# Altium project _stm32h7-hmi-display.PrjPCB (part 2 of 2)

## Sheet 08_POWER.SchDoc: =GlobalProjectName
size 594 x 420 mm; ApprovedBy: Галкин; CheckedBy: Галкин; Author: Данич; Organization: A_D Electronics; DocumentNumber: - Э3; Revision: 0; SheetNumber: 8; SheetTotal: 8; PageSetup: Record=PageOptions|CenterHorizontal=True|CenterVertical=True|PrintScale=0.70|XCorrection=1.00|YCorrection=1.00|PrintKind=2|BorderSize=5000000|LeftOffset=9000|BottomOffset=10100|Orientation=2|PaperLength=11176|PaperWidth=8636|Scale=100|PaperSource=259|PrintQuality=-3|MediaType=1|DitherType=10|PrintScaleMode=1|PaperKind=A3|PaperIndex=8; FirstApplication: -; DocumentName: stm32h7-hmi-display
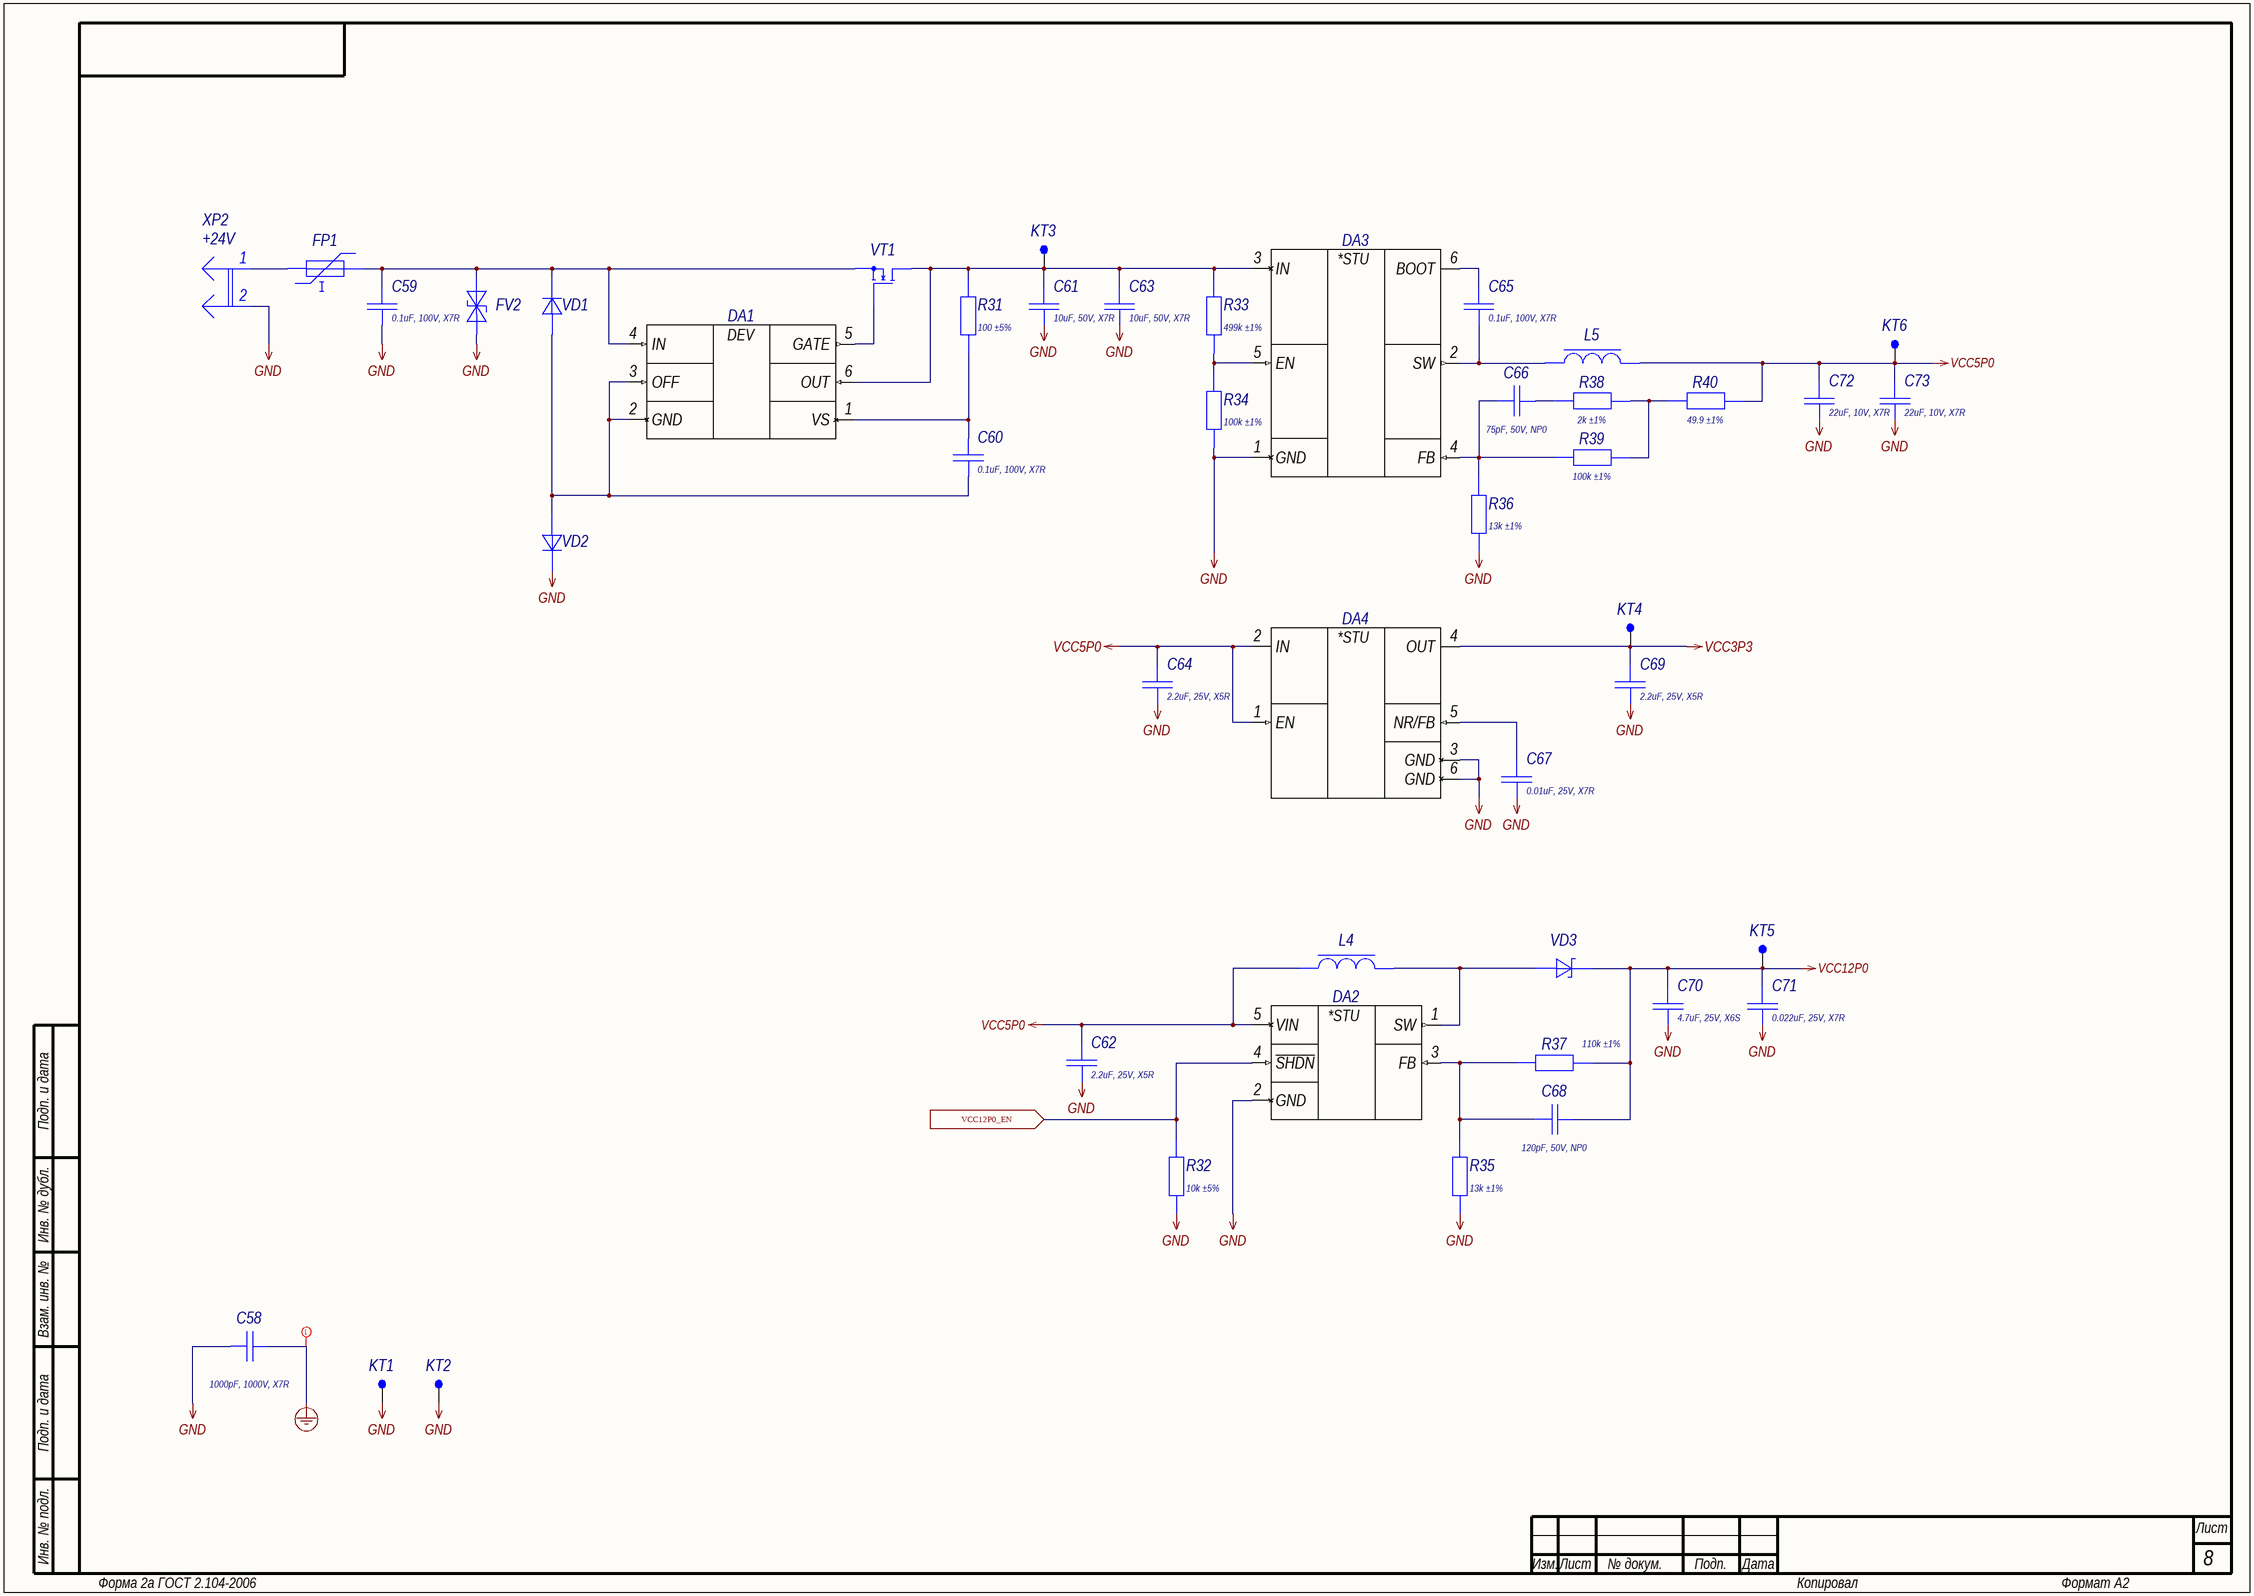
[diagram p7: 08_POWER.SchDoc]

### Parts
C58  Schematic Value: 1000pF, 1000V, X7R  [C1206]  (hidden comment: Capacitor)
C59  Schematic Value: 0.1uF, 100V, X7R  [C0603_L]  (hidden comment: Capacitor)
C60  Schematic Value: 0.1uF, 100V, X7R  [C0603_L]  (hidden comment: Capacitor)
C61  Schematic Value: 10uF, 50V, X7R  [C1210_L]  (hidden comment: Capacitor)
C62  Schematic Value: 2.2uF, 25V, X5R  [C0603_L]  (hidden comment: Capacitor)
C63  Schematic Value: 10uF, 50V, X7R  [C1210_L]  (hidden comment: Capacitor)
C64  Schematic Value: 2.2uF, 25V, X5R  [C0603_L]  (hidden comment: Capacitor)
C65  Schematic Value: 0.1uF, 100V, X7R  [C0603_L]  (hidden comment: Capacitor)
C66  Schematic Value: 75pF, 50V, NP0  [C0402_L]  (hidden comment: Capacitor)
C67  Schematic Value: 0.01uF, 25V, X7R  [C0402_L]  (hidden comment: Capacitor)
C68  Schematic Value: 120pF, 50V, NP0  [C0402_L]  (hidden comment: Capacitor)
C69  Schematic Value: 2.2uF, 25V, X5R  [C0603_L]  (hidden comment: Capacitor)
C70  Schematic Value: 4.7uF, 25V, X6S  [C0603_L]  (hidden comment: Capacitor)
C71  Schematic Value: 0.022uF, 25V, X7R  [C0402_L]  (hidden comment: Capacitor)
C72  Schematic Value: 22uF, 10V, X7R  [C1206_L]  (hidden comment: Capacitor)
C73  Schematic Value: 22uF, 10V, X7R  [C1206_L]  (hidden comment: Capacitor)
DA1  LM5050-1  [SOT-23-6_095P290X160X145_N]  (value not drawn)
DA2  LMR64010XMF  [SOT-23-5_095P290X160X145_N]  (value not drawn)
DA3  TPS54308  [SOT-23-6_095P290X160X145_N]  (value not drawn)
DA4  TPS786xxDCQ-Series  [SOT-223-6_127P650X350X180_N]  (value not drawn)
FP1  Fuse_PTC  [F1812_L_H085]  (value not drawn)
FV2  Suppressor-Bi  [SOD-123FL]  (value not drawn)
KT1  GND  [TP-SMT-R-0.8mm]  (value not drawn)  (no BOM)
KT2  GND  [TP-SMT-R-0.8mm]  (value not drawn)  (no BOM)
KT3  VCCIN  [TP-SMT-C-0.5mm]  (value not drawn)  (no BOM)
KT4  3.3V  [TP-SMT-C-0.5mm]  (value not drawn)  (no BOM)
KT5  12.0V  [TP-SMT-C-0.5mm]  (value not drawn)  (no BOM)
KT6  5.0V  [TP-SMT-C-0.5mm]  (value not drawn)  (no BOM)
L4  Coil  [SRP3020TA-Series]  (value not drawn)
L5  Coil  [SRP7028C-Series]  (value not drawn)
R31  Schematic Value: 100 ±5%  [R0603_L]  (hidden comment: Resistor)
R32  Schematic Value: 10k ±5%  [R0402_L]  (hidden comment: Resistor)
R33  Schematic Value: 499k ±1%  [R0402_L]  (hidden comment: Resistor)
R34  Schematic Value: 100k ±1%  [R0402_L]  (hidden comment: Resistor)
R35  Schematic Value: 13k ±1%  [R0402_L]  (hidden comment: Resistor)
R36  Schematic Value: 13k ±1%  [R0402_L]  (hidden comment: Resistor)
R37  Schematic Value: 110k ±1%  [R0402_L]  (hidden comment: Resistor)
R38  Schematic Value: 2k ±1%  [R0402_L]  (hidden comment: Resistor)
R39  Schematic Value: 100k ±1%  [R0402_L]  (hidden comment: Resistor)
R40  Schematic Value: 49.9 ±1%  [R0402_L]  (hidden comment: Resistor)
VD1  Diode  [SOD-523]  (value not drawn)
VD2  Diode  [SOD-523]  (value not drawn)
VD3  Schottky  [SOD-123]  (value not drawn)
VT1  MOSFET-N_32  [SOT-23_190P290X160X145_N]  (value not drawn)
XP2  +24V  [1827868]

### Ports
VCC12P0_EN (in)

### Nets
EARTH: C58.2
GND: C58.1 C59.1 C61.1 C62.1 C63.1 C64.1 C67.1 C69.1 C70.1 C71.1 C72.1 C73.1 DA2.2(GND) DA3.1(GND) DA4.3(GND) DA4.6(GND) FV2.1(А) KT1.1 KT2.1 R32.1 R34.1 R35.1 R36.1 VD2.2(К) XP2.2
VCC3P3: C69.2 DA4.4(OUT) KT4.1
VCC5P0: C62.2 C64.2 C72.2 C73.2 DA2.5(VIN) DA4.1(EN) DA4.2(IN) KT6.1 L4.1 L5.2 R40.2
VCC12P0: C68.2 C70.2 C71.2 KT5.1 R37.1 VD3.2(К)
LCD_PWR_EN: DA2.4(~{SHDN}) R32.2 ; port VCC12P0_EN
NetC59_2: C59.2 DA1.4(IN) FP1.2 FV2.2(К) VD1.2(К) VT1.2(S)
NetC60_1: C60.1 DA1.2(GND) DA1.3(OFF) VD1.1(А) VD2.1(А)
NetC60_2: C60.2 DA1.1(VS) R31.1
NetC61_2: C61.2 C63.2 DA1.6(OUT) DA3.3(IN) KT3.1 R31.2 R33.2 VT1.3(D)
NetC65_1: C65.1 DA3.2(SW) L5.1
NetC65_2: C65.2 DA3.6(BOOT)
NetC66_1: C66.1 DA3.4(FB) R36.2 R39.1
NetC66_2: C66.2 R38.1
NetC67_2: C67.2 DA4.5(NR/FB)
NetC68_1: C68.1 DA2.3(FB) R35.2 R37.2
NetDA1_5: DA1.5(GATE) VT1.1(G)
NetDA2_1: DA2.1(SW) L4.2 VD3.1(А)
NetDA3_5: DA3.5(EN) R33.1 R34.2
NetFP1_1: FP1.1 XP2.1
NetR38_2: R38.2 R39.2 R40.1

### Layout directives
net class HV: EARTH

### Notes on the sheet
- Подп. и дата
- Инв. № дубл.
- Взам. инв. №
- Инв. № подл.
- Изм.
- Лист
- № докум.
- Подп.
- Дата
- Форма 2а ГОСТ 2.104-2006
- Копировал
- Формат А2
- (in symbol LM5050MK-1/NOPB) DEV
- (in symbol LMR64010XMFX/NOPB) *STU
- (in symbol TPS54308DDCR) *STU
- (in symbol TPS78633DCQR) *STU

### Library data of the parts
C58 = GRM31BR73A102KW01L: Manufacturer: Murata; Type: Конденсатор; ID: 218; Value: 1000pF; Voltage: 1000V; Tolerance: ±10%; Dielectric Type: X7R; Application Category: 1; Working Temperature Min: -55°С; Working Temperature Max: +125°С; Published: 18.05.2010; Publisher: Andrew Danich; Part Number: GRM31BR73A102KW01L; Footprint: 1206; ClassName: DirectConnect
C59 C60 C65 = GRM188R72A104KA35D: Manufacturer: Murata; Type: Конденсатор; ID: 232; Value: 0.1uF; Voltage: 100V; Tolerance: ±10%; Dielectric Type: X7R; Application Category: 1; Working Temperature Min: -55°С; Working Temperature Max: +125°С; Published: 18.05.2010; Publisher: Andrew Danich; Part Number: GRM188R72A104KA35D; Footprint: 0603
  C59 C65: ClassName: DirectConnect
C61 C63 = GRM32ER71H106KA12L: Manufacturer: Murata; Type: Конденсатор; ID: 260; Value: 10uF; Voltage: 50V; Tolerance: ±10%; Dielectric Type: X7R; Application Category: 1; Working Temperature Min: -55°С; Working Temperature Max: +125°С; Published: 18.05.2010; Publisher: Andrew Danich; Part Number: GRM32ER71H106KA12L; Footprint: 1210; ClassName: DirectConnect
C62 C64 C69 = GRM188R61E225MA12D: Manufacturer: Murata; Type: Конденсатор; ID: 152; Value: 2.2uF; Voltage: 25V; Tolerance: ±20%; Dielectric Type: X5R; Application Category: 1; Working Temperature Min: -55°С; Working Temperature Max: +85°С; Published: 18.05.2010; Publisher: Andrew Danich; Part Number: GRM188R61E225MA12D; Footprint: 0603; ClassName: DirectConnect
C66 = GCM1555C1H750JA16D: Manufacturer: Murata; Type: Конденсатор; ID: 264; Value: 75pF; Voltage: 50V; Tolerance: ±5%; Dielectric Type: NP0; Application Category: 1; Working Temperature Min: -55°С; Working Temperature Max: +125°С; Published: 18.05.2010; Publisher: Andrew Danich; Part Number: GCM1555C1H750JA16D; Footprint: 0402
C67 = GCM155R71E103KA37D: Manufacturer: Murata; Type: Конденсатор; ID: 150; Value: 0.01uF; Voltage: 25V; Tolerance: ±10%; Dielectric Type: X7R; Application Category: 1; Working Temperature Min: -55°С; Working Temperature Max: +125°С; Functional Analog: GRM155R71E103KA01D; Published: 18.05.2010; Publisher: Andrew Danich; Part Number: GCM155R71E103KA37D; Footprint: 0402; ClassName: DirectConnect
C68 = GRM1555C1H121JA01D: Manufacturer: Murata; Type: Конденсатор; ID: 259; Value: 120pF; Voltage: 50V; Tolerance: ±5%; Dielectric Type: NP0; Application Category: 1; Working Temperature Min: -55°С; Working Temperature Max: +125°С; Published: 18.05.2010; Publisher: Andrew Danich; Part Number: GRM1555C1H121JA01D; Footprint: 0402
C70 = GRM188C81E475KE11D: Manufacturer: Murata; Type: Конденсатор; ID: 265; Value: 4.7uF; Voltage: 25V; Tolerance: ±10%; Dielectric Type: X6S; Application Category: 1; Working Temperature Min: -55°С; Working Temperature Max: +105°С; Functional Analog: GRT188C81E475KE13D; Published: 18.05.2010; Publisher: Andrew Danich; Part Number: GRM188C81E475KE11D; Footprint: 0603; ClassName: DirectConnect
C71 = GCM155R71E223KA55D: Manufacturer: Murata; Type: Конденсатор; ID: 170; Value: 0.022uF; Voltage: 25V; Tolerance: ±10%; Dielectric Type: X7R; Application Category: 1; Working Temperature Min: -55°С; Working Temperature Max: +125°С; Functional Analog: GRM155R71E223KA61D; Published: 18.05.2010; Publisher: Andrew Danich; Part Number: GCM155R71E223KA55D; Footprint: 0402; ClassName: DirectConnect
C72 C73 = GRM31CR71A226KE15L: Manufacturer: Murata; Type: Конденсатор; ID: 238; Value: 22uF; Voltage: 10V; Tolerance: ±10%; Dielectric Type: X7R; Application Category: 1; Working Temperature Min: -55°С; Working Temperature Max: +125°С; Published: 18.05.2010; Publisher: Andrew Danich; Part Number: GRM31CR71A226KE15L; Footprint: 1206; ClassName: DirectConnect
DA1 = LM5050MK-1/NOPB: Manufacturer: Texas Instruments; ID: 2; Startup Voltage: +5V; Supply Current: 790uA; Max Input AC Voltage: 75V; MOSFET Type: N-Channel MOSFET; Duty Cycle: 100%; Application Category: 1; Working Temperature Min: -40°С; Working Temperature Max: +125°С; Functional Analog: LM5050MKX-1/NOPB; Published: 08.12.2018; Publisher: Andrew Danich; Type: Микросхема; Part Number: LM5050MK-1/NOPB; Value: LM5050MK-1/NOPB; ClassName: DirectConnect
DA2 = LMR64010XMFX/NOPB: Manufacturer: Texas Instruments; ID: 25; Input Voltage: +2.7…14V; Output Current: 1A; Output Voltage: +3.0…40.0V; Shutdown Input: YES; Frequency: 1.6MHz; Application Category: 1; Working Temperature Min: -40°С; Working Temperature Max: +125°С; Functional Analog: LMR64010XMF/NOPB, LMR64010XMFE/NOPB; Type: Микросхема; Published: 23.05.2020; Publisher: Andrew Danich; Part Number: LMR64010XMFX/NOPB; Value: LMR64010XMFX/NOPB; ClassName: DirectConnect
DA3 = TPS54308DDCR: Manufacturer: Texas Instruments; ID: 73; Input Voltage: +4.5…28.0V; Output Current: 3A; Output Voltage: +0.6…26V; Efficiency: 90%; Shutdown Input: YES; Frequency: 350kHz; Application Category: 1; Working Temperature Min: -40°С; Working Temperature Max: +125°С; Functional Analog: TPS54308DDCT; Type: Микросхема; Published: 23.05.2020; Publisher: Andrew Danich; Part Number: TPS54308DDCR; Value: TPS54308DDCR; ClassName: DirectConnect
DA4 = TPS78633DCQR: Manufacturer: Texas Instruments; ID: 38; Input Voltage: +3.69…5.5V; Output Current: 1.5A; Output Voltage: +3.3V; RMS Noise: 48uV; Application Category: 1; Working Temperature Min: -40°С; Working Temperature Max: +150°С; Functional Analog: TPS78633DCQT; Published: 05.06.2020; Publisher: Andrew Danich; Type: Микросхема; Part Number: TPS78633DCQR; Value: TPS78633DCQR; ClassName: DirectConnect
FP1 = MF-MSMF050/40X-2: Manufacturer: Bourns; ID: 21; Limit Voltage: 40V; Hold Current: 0.5A; Resistance: 1.3ohm; Trip Current: 1A; Current Rating Max: 20A; Application Category: 1; Working Temperature Min: -40°С; Working Temperature Max: +85°С; Published: 25.0.2017; Value: MF-MSMF050/40X-2; Type: Предохранитель самовосстанавливающийся; Part Number: MF-MSMF050/40X-2; ClassName: DirectConnect
FV2 = SMF4L36CA: Manufacturer: LittleFuse; ID: 32; Breakdown Voltage: 40V; Reverse Stand Off Voltage: 36V; Peak Forward Current: 6.9A; Pulse Power Dissipation: 400W; Directional: Bidirectional; Application Category: 1; Working Temperature Min: -55°С; Working Temperature Max: +150°С; Published: 27.07.2015; Publisher: Andrew Danich; Type: Супрессор; Part Number: SMF4L36CA; Value: SMF4L36CA; ClassName: DirectConnect
KT1 KT2 = TestPoint-SMT-GND: ID: 7; Application Type: On PCB Test Point; Application Category: 1; Published: 03.03.2015; Publisher: Andrew Danich; Part Number: TestPoint-SMT-GND; Value: TestPoint-SMT; Manufacturer: -; Functional Analog: -
KT3-KT6 = TestPoint-SMT: ID: 6; Application Type: On PCB Test Point; Application Category: 1; Published: 03.03.2015; Publisher: Andrew Danich; Part Number: TestPoint-SMT; Value: TestPoint-SMT; Manufacturer: -; Functional Analog: -
L4 = SRP3020TA-4R7M: Manufacturer: Bourns; Type: Дроссель; ID: 27; Rated Current: 2.6A; Tolerance: ±20%; Inductance: 4.7uH; Q: 10; DC Resistance: 0.2ohm; Self-Resonant Frequency: 34MHz; Application Category: 1; Working Temperature Min: -40°С; Working Temperature Max: +150°С; Published: 20.05.2010; Publisher: Andrew Danich; Part Number: SRP3020TA-4R7M; Value: SRP3020TA-4R7M; Footprint: SRP3020TA; ClassName: DirectConnect
L5 = SRP7028C-150M: Manufacturer: Bourns; Type: Дроссель; ID: 40; Rated Current: 3A; Tolerance: ±20%; Inductance: 15uH; Q: 20; DC Resistance: 0.107ohm; Self-Resonant Frequency: 12MHz; Application Category: 1; Working Temperature Min: -40°С; Working Temperature Max: +125°С; Functional Analog: SLO0630H150MTT; Published: 20.05.2010; Publisher: Andrew Danich; Part Number: SRP7028C-150M; Value: SRP7028C-150M; Footprint: SRP7028C; ClassName: DirectConnect
R31 = RC0603JR-07100R: Manufacturer: Yageo; ID: 10; Value: 100; Limit Voltage: 50V; Tolerance: ±5%; Temperature Coefficient: 100ppm; Total Power Dissipation: 0.1W; Series Type: Thick-Film; Application Category: 1; Working Temperature Min: -55°С; Working Temperature Max: +155°С; Functional Analog: CR0603-JW-101E; Published: 24.03.2010; Publisher: Andrew Danich; Type: Резистор; Part Number: RC0603JR-07100R; Footprint: 0603
R32 = RC0402JR-0710KL: Manufacturer: Yageo; ID: 476; Value: 10k; Limit Voltage: 50V; Tolerance: ±5%; Temperature Coefficient: 100ppm; Total Power Dissipation: 0.1W; Series Type: Thick-Film; Application Category: 1; Working Temperature Min: -55°С; Working Temperature Max: +155°С; Published: 24.03.2010; Publisher: Andrew Danich; Type: Резистор; Part Number: RC0402JR-0710KL; Footprint: 0402
R33 = RC0402FR-07499KL: Manufacturer: Yageo; ID: 487; Value: 499k; Limit Voltage: 50V; Tolerance: ±1%; Temperature Coefficient: 100ppm; Total Power Dissipation: 0.1W; Series Type: Thick-Film; Application Category: 1; Working Temperature Min: -55°С; Working Temperature Max: +155°С; Published: 24.03.2010; Publisher: Andrew Danich; Type: Резистор; Part Number: RC0402FR-07499KL; Footprint: 0402
R34 R39 = RC0402FR-07100KL: Manufacturer: Yageo; ID: 1; Value: 100k; Limit Voltage: 50V; Tolerance: ±1%; Temperature Coefficient: 100ppm; Total Power Dissipation: 0.1W; Series Type: Thick-Film; Working Temperature Min: -55°С; Working Temperature Max: +155°С; Published: 24.03.2010; Publisher: Andrew Danich; Type: Резистор; Part Number: RC0402FR-07100KL; Footprint: 0402; Application Category: 1
R35 R36 = RC0402FR-0713KL: Manufacturer: Yageo; ID: 445; Value: 13k; Limit Voltage: 50V; Tolerance: ±1%; Temperature Coefficient: 100ppm; Total Power Dissipation: 0.1W; Series Type: Thick-Film; Application Category: 1; Working Temperature Min: -55°С; Working Temperature Max: +155°С; Published: 24.03.2010; Publisher: Andrew Danich; Type: Резистор; Part Number: RC0402FR-0713KL; Footprint: 0402
R37 = RC0402FR-07110KL: Manufacturer: Yageo; ID: 559; Value: 110k; Limit Voltage: 50V; Tolerance: ±1%; Temperature Coefficient: 100ppm; Total Power Dissipation: 0.1W; Series Type: Thick-Film; Application Category: 1; Working Temperature Min: -55°С; Working Temperature Max: +155°С; Published: 24.03.2010; Publisher: Andrew Danich; Type: Резистор; Part Number: RC0402FR-07110KL; Footprint: 0402
R38 = RC0402FR-072KL: Manufacturer: Yageo; ID: 480; Value: 2k; Limit Voltage: 50V; Tolerance: ±1%; Temperature Coefficient: 100ppm; Total Power Dissipation: 0.1W; Series Type: Thick-Film; Application Category: 1; Working Temperature Min: -55°С; Working Temperature Max: +155°С; Published: 24.03.2010; Publisher: Andrew Danich; Type: Резистор; Part Number: RC0402FR-072KL; Footprint: 0402
R40 = RC0402FR-0749R9L: Manufacturer: Yageo; ID: 491; Value: 49.9; Limit Voltage: 50V; Tolerance: ±1%; Temperature Coefficient: 100ppm; Total Power Dissipation: 0.1W; Series Type: Thick-Film; Application Category: 1; Working Temperature Min: -55°С; Working Temperature Max: +155°С; Published: 24.03.2010; Publisher: Andrew Danich; Type: Резистор; Part Number: RC0402FR-0749R9L; Footprint: 0402
VD1 VD2 = 1N4148WT-7: Manufacturer: Diodes Incorporated; Type: Диод; ID: 18; Reverse Voltage: 100V; Reverse Current: 1uA; Forward Current: 250mA; Application Category: 1; Total Power Dissipation: 200mW; Recovery Time: 4nS; Forward Voltage: 1.25V; Capacitance: 2pF; Working Temperature Min: -65°С; Working Temperature Max: +150°С; Functional Analog: 1N4148X-TP; Published: 18.05.2010; Publisher: Andrew Danich; Part Number: 1N4148WT-7; Value: 1N4148WT-7; ClassName: DirectConnect
VD3 = MBR0540T1G: Manufacturer: ON Semiconductor; Type: Диод; ID: 11; Reverse Voltage: 40V; Reverse Current: 250uA; Forward Voltage: 0.51V; Forward Current: 0.5A; Total Power Dissipation: 410mW; Capacitance: 170pF; Application Category: 1; Working Temperature Min: -55°С; Working Temperature Max: +150°С; Published: 18.05.2010; Publisher: Andrew Danich; Part Number: MBR0540T1G; Value: MBR0540T1G; Functional Analog: MBR0540; ClassName: DirectConnect
VT1 = IRLML0030TRPBF: Manufacturer: International Rectifier; Type: Транзистор; ID: 27; D-S Voltage: 30V; Drain Current: 5.3A; D-S On-Resistance: 0.04omh; Gate Capacitance: 382pF; Total Power Dissipation: 1.3W; Gate Threshold Voltage: 2.3V; Application Category: 1; Working Temperature Min: -55°С; Working Temperature Max: +150°С; Published: 24.09.2010; Publisher: Andrew Danich; Part Number: IRLML0030TRPBF; Value: IRLML0030TRPBF; ClassName: DirectConnect
XP2 = 1827868: Manufacturer: Phoenix Contact; ID: 23; Limit Voltage: 300V; Limit Current: 8A; Surface Finish: Brass, tin-plated; Pitch: 3.81mm; Application Category: 1; Working Temperature Min: -40°С; Working Temperature Max: +100°С; Functional Analog: ECH381RM-02P, WJ15EDGRM-3.81-2P; Value: 1827868; Published: 07.03.2013; Publisher: Andrew Danich; Type: Вилка; Part Number: 1827868; Pins: 2; Wire Range: -; ClassName: DirectConnect

## Nets that join several sheets
EARTH: C0 (XS4.C0.SH), C1 (XS4.C1.SH), 08_POWER (C58.2)
GND: 02_H7_IO (18 pins), 04_SDRAM (24 pins), 03_H7_PWR (33 pins), 05_LCD_LVDS (42 pins), C0 (9 pins), C1 (9 pins), 07_WI-FI (6 pins), 08_POWER (25 pins)
VCC3P3: 02_H7_IO (20 pins), 04_SDRAM (24 pins), 03_H7_PWR (33 pins), 05_LCD_LVDS (19 pins), C0 (C50.C0.2 C51.C0.2 DD6.C0.1), C1 (C50.C1.2 C51.C1.2 DD6.C1.1), 07_WI-FI (12 pins), 08_POWER (C69.2 DA4.4 KT4.1)
VCC5P0: C0 (A1.C0.2 C52.C0.2), C1 (A1.C1.2 C52.C1.2), 08_POWER (11 pins)
VCC12P0: 05_LCD_LVDS (XS3.38 XS3.39 XS3.40), 08_POWER (6 pins)
ADDR0: 02_H7_IO (DD1.16), 04_SDRAM (DD4.25)
ADDR1: 02_H7_IO (DD1.17), 04_SDRAM (DD4.26)
ADDR2: 02_H7_IO (DD1.18), 04_SDRAM (DD4.27)
ADDR3: 02_H7_IO (DD1.19), 04_SDRAM (DD4.60)
ADDR4: 02_H7_IO (DD1.20), 04_SDRAM (DD4.61)
ADDR5: 02_H7_IO (DD1.21), 04_SDRAM (DD4.62)
ADDR6: 02_H7_IO (DD1.60), 04_SDRAM (DD4.63)
ADDR7: 02_H7_IO (DD1.63), 04_SDRAM (DD4.64)
ADDR8: 02_H7_IO (DD1.64), 04_SDRAM (DD4.65)
ADDR9: 02_H7_IO (DD1.65), 04_SDRAM (DD4.66)
ADDR10: 02_H7_IO (DD1.66), 04_SDRAM (DD4.24)
ADDR11: 02_H7_IO (DD1.67), 04_SDRAM (DD4.21)
ADDR12: 02_H7_IO (DD1.106), 04_SDRAM (DD4.69)
BA0: 02_H7_IO (DD1.108), 04_SDRAM (DD4.22)
BA1: 02_H7_IO (DD1.109), 04_SDRAM (DD4.23)
CAN_GLED0: 02_H7_IO (DD1.162), C0 (R25.C0.1)
CAN_GLED1: 02_H7_IO (DD1.157), C1 (R25.C1.1)
CAN_RX0: 02_H7_IO (DD1.163), C0 (DD6.C0.3)
CAN_RX1: 02_H7_IO (DD1.122), C1 (DD6.C1.3)
CAN_TX0: 02_H7_IO (DD1.164), C0 (DD6.C0.6)
CAN_TX1: 02_H7_IO (DD1.123), C1 (DD6.C1.6)
CAN_YLED0: 02_H7_IO (DD1.161), C0 (R26.C0.1)
CAN_YLED1: 02_H7_IO (DD1.156), C1 (R26.C1.1)
CAS_N: 02_H7_IO (DD1.160), 04_SDRAM (DD4.18)
CKE: 02_H7_IO (DD1.84), 04_SDRAM (DD4.67)
CLK: 02_H7_IO (DD1.112), 04_SDRAM (DD4.68)
CS_N: 02_H7_IO (DD1.83), 04_SDRAM (DD4.20)
DATA0: 02_H7_IO (DD1.104), 04_SDRAM (DD4.2)
DATA1: 02_H7_IO (DD1.105), 04_SDRAM (DD4.4)
DATA2: 02_H7_IO (DD1.142), 04_SDRAM (DD4.5)
DATA3: 02_H7_IO (DD1.143), 04_SDRAM (DD4.7)
DATA4: 02_H7_IO (DD1.68), 04_SDRAM (DD4.8)
DATA5: 02_H7_IO (DD1.69), 04_SDRAM (DD4.10)
DATA6: 02_H7_IO (DD1.70), 04_SDRAM (DD4.11)
DATA7: 02_H7_IO (DD1.73), 04_SDRAM (DD4.13)
DATA8: 02_H7_IO (DD1.74), 04_SDRAM (DD4.74)
DATA9: 02_H7_IO (DD1.75), 04_SDRAM (DD4.76)
DATA10: 02_H7_IO (DD1.76), 04_SDRAM (DD4.77)
DATA11: 02_H7_IO (DD1.77), 04_SDRAM (DD4.79)
DATA12: 02_H7_IO (DD1.78), 04_SDRAM (DD4.80)
DATA13: 02_H7_IO (DD1.96), 04_SDRAM (DD4.82)
DATA14: 02_H7_IO (DD1.97), 04_SDRAM (DD4.83)
DATA15: 02_H7_IO (DD1.98), 04_SDRAM (DD4.85)
DATA16: 02_H7_IO (DD1.85), 04_SDRAM (DD4.31)
DATA17: 02_H7_IO (DD1.86), 04_SDRAM (DD4.33)
DATA18: 02_H7_IO (DD1.87), 04_SDRAM (DD4.34)
DATA19: 02_H7_IO (DD1.88), 04_SDRAM (DD4.36)
DATA20: 02_H7_IO (DD1.89), 04_SDRAM (DD4.37)
DATA21: 02_H7_IO (DD1.128), 04_SDRAM (DD4.39)
DATA22: 02_H7_IO (DD1.129), 04_SDRAM (DD4.40)
DATA23: 02_H7_IO (DD1.130), 04_SDRAM (DD4.42)
DATA24: 02_H7_IO (DD1.131), 04_SDRAM (DD4.45)
DATA25: 02_H7_IO (DD1.132), 04_SDRAM (DD4.47)
DATA26: 02_H7_IO (DD1.133), 04_SDRAM (DD4.48)
DATA27: 02_H7_IO (DD1.134), 04_SDRAM (DD4.50)
DATA28: 02_H7_IO (DD1.175), 04_SDRAM (DD4.51)
DATA29: 02_H7_IO (DD1.176), 04_SDRAM (DD4.53)
DATA30: 02_H7_IO (DD1.11), 04_SDRAM (DD4.54)
DATA31: 02_H7_IO (DD1.12), 04_SDRAM (DD4.56)
DQM0: 02_H7_IO (DD1.169), 04_SDRAM (DD4.16)
DQM1: 02_H7_IO (DD1.170), 04_SDRAM (DD4.71)
DQM2: 02_H7_IO (DD1.173), 04_SDRAM (DD4.28)
DQM3: 02_H7_IO (DD1.174), 04_SDRAM (DD4.59)
LCD_BL_EN: 02_H7_IO (DD1.54), 05_LCD_LVDS (R12.2 XS3.36)
LCD_BL_PWM: 02_H7_IO (DD1.53), 05_LCD_LVDS (R13.2 XS3.35)
LCD_CLK: 02_H7_IO (DD1.111), 05_LCD_LVDS (DD5.31)
LCD_DATA0: 02_H7_IO (DD1.43), 05_LCD_LVDS (DD5.51)
LCD_DATA1: 02_H7_IO (DD1.42), 05_LCD_LVDS (DD5.52)
LCD_DATA2: 02_H7_IO (DD1.41), 05_LCD_LVDS (DD5.54)
LCD_DATA3: 02_H7_IO (DD1.56), 05_LCD_LVDS (DD5.55)
LCD_DATA4: 02_H7_IO (DD1.51), 05_LCD_LVDS (DD5.56)
LCD_DATA5: 02_H7_IO (DD1.110), 05_LCD_LVDS (DD5.2)
LCD_DATA6: 02_H7_IO (DD1.32), 05_LCD_LVDS (DD5.3)
LCD_DATA7: 02_H7_IO (DD1.4), 05_LCD_LVDS (DD5.4)
LCD_DATA8: 02_H7_IO (DD1.5), 05_LCD_LVDS (DD5.6)
LCD_DATA9: 02_H7_IO (DD1.52), 05_LCD_LVDS (DD5.7)
LCD_DATA10: 02_H7_IO (DD1.13), 05_LCD_LVDS (DD5.8)
LCD_DATA11: 02_H7_IO (DD1.145), 05_LCD_LVDS (DD5.10)
LCD_DATA12: 02_H7_IO (DD1.153), 05_LCD_LVDS (DD5.11)
LCD_DATA13: 02_H7_IO (DD1.45), 05_LCD_LVDS (DD5.12)
LCD_DATA14: 02_H7_IO (DD1.80), 05_LCD_LVDS (DD5.14)
LCD_DATA15: 02_H7_IO (DD1.3), 05_LCD_LVDS (DD5.15)
LCD_DATA16: 02_H7_IO (DD1.167), 05_LCD_LVDS (DD5.16)
LCD_DATA17: 02_H7_IO (DD1.168), 05_LCD_LVDS (DD5.18)
LCD_DATA18: 02_H7_IO (DD1.155), 05_LCD_LVDS (DD5.19)
LCD_DATA19: 02_H7_IO (DD1.150), 05_LCD_LVDS (DD5.20)
LCD_DATA20: 02_H7_IO (DD1.119), 05_LCD_LVDS (DD5.22)
LCD_DATA21: 02_H7_IO (DD1.121), 05_LCD_LVDS (DD5.23)
LCD_DATA22: 02_H7_IO (DD1.47), 05_LCD_LVDS (DD5.24)
LCD_DATA23: 02_H7_IO (R1.1), 05_LCD_LVDS (DD5.25)
LCD_DATA24: 02_H7_IO (DD1.115), 05_LCD_LVDS (DD5.27)
LCD_DATA25: 02_H7_IO (DD1.50), 05_LCD_LVDS (DD5.28)
LCD_DATA26: 02_H7_IO (DD1.28), 05_LCD_LVDS (DD5.30)
LCD_DATA27: 02_H7_IO (DD1.57), 05_LCD_LVDS (DD5.50)
LCD_I2C_SCL: 02_H7_IO (DD1.100), 05_LCD_LVDS (R21.2 XS3.6)
LCD_I2C_SDA: 02_H7_IO (DD1.101), 05_LCD_LVDS (R22.2 XS3.7)
LCD_PWR_EN: 02_H7_IO (DD1.55), 08_POWER (DA2.4 R32.2)
LCD_SHTDN: 02_H7_IO (DD1.31 XP1.5 XS1.10), 05_LCD_LVDS (DD5.32 XS3.30), 07_WI-FI (R27.1)
RAS_N: 02_H7_IO (DD1.59), 04_SDRAM (DD4.19)
WE_N: 02_H7_IO (DD1.46), 04_SDRAM (DD4.17)
WIFI_RX: 02_H7_IO (DD1.93), 07_WI-FI (DD7.41)
WIFI_TX: 02_H7_IO (DD1.92), 07_WI-FI (DD7.40)